# EAGLE design MasTer_Controler_Route_Fix (EAGLE 6.6.0)

## Sheet 1 of 2: PH Meter
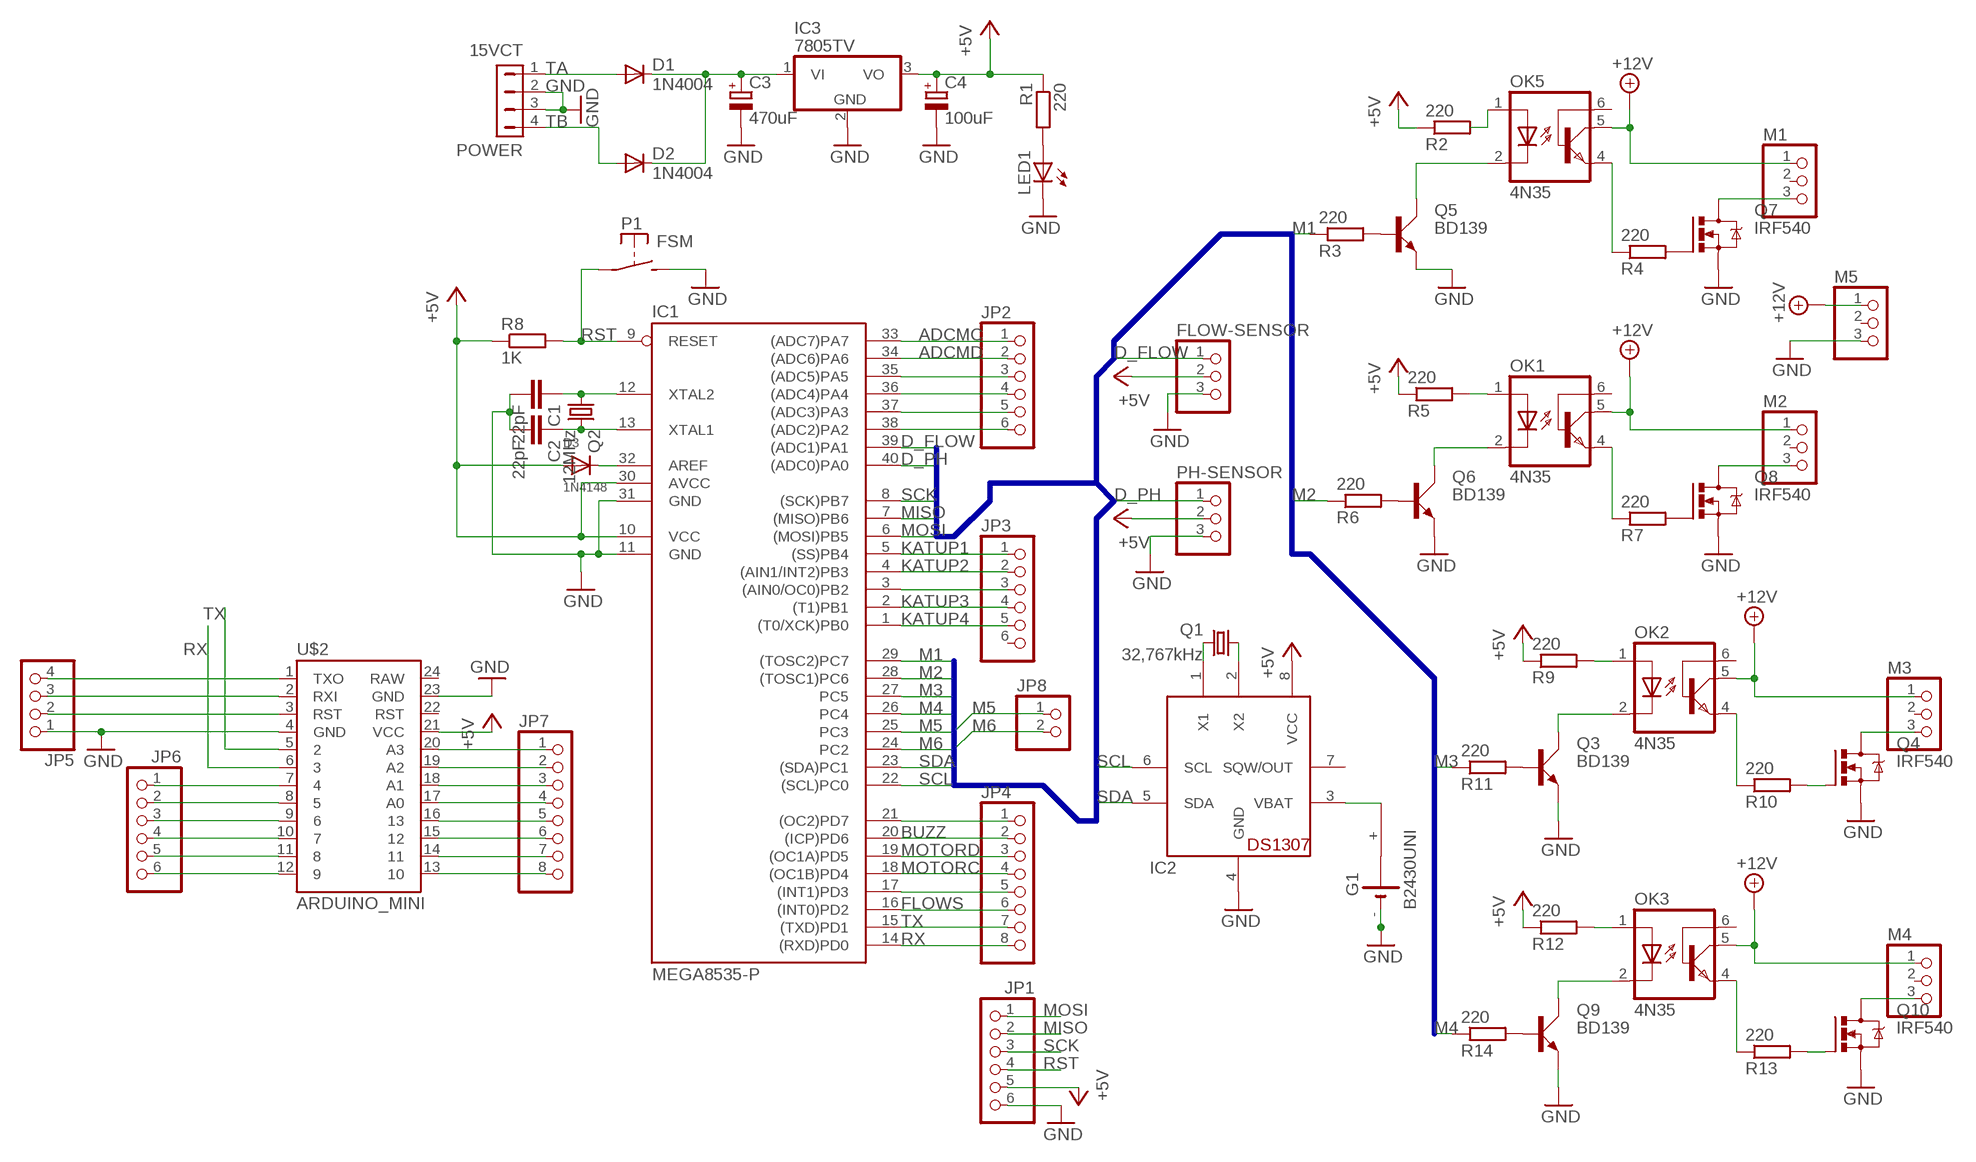
[diagram p0: schematic, sheet 1]

### Parts
15VCT  POWER  HDR-1X4-MTA-100  [MTA-100-4V]
C1  22pF  C2.5/4  [C2.5-4]
C2  22pF  C2.5/4  [C2.5-4]
C3  470uF  CPOL-EUE5-6  [E5-6]
C4  100uF  CPOL-EUE5-6  [E5-6]
D1  1N4004  [DO41-10]
D2  1N4004  [DO41-10]
D3  1N4148  DIODEDO-1N4148  [DO-1N4148]
FLOW-SENSOR  PINHD-1X3  [1X03]
G1  B2430UNI  [B2430UNI]
IC1  MEGA8535-P  [DIL40]
IC2  DS1307  [DIL08]
IC3  7805TV  [TO220V]
JP1  PINHD-1X6  [1X06]
JP2  PINHD-1X6  [1X06]
JP3  PINHD-1X6  [1X06]
JP4  PINHD-1X8CLEANBIG  [1X08-CLEANBIG]
JP5  PINHD-1X4  [1X04]
JP6  PINHD-1X6CB  [1X06-CLEANBIG]
JP7  PINHD-1X8CLEANBIG  [1X08-CLEANBIG]
JP8  PINHD-1X2  [1X02]
LED1  LED5MM  [LED5MM]
M1  PINHD-1X3  [1X03]
M2  PINHD-1X3  [1X03]
M3  PINHD-1X3  [1X03]
M4  PINHD-1X3  [1X03]
M5  PINHD-1X3  [1X03]
OK1  4N35  [DIL06]
OK2  4N35  [DIL06]
OK3  4N35  [DIL06]
OK5  4N35  [DIL06]
P1  FSM  [FSM]
PH-SENSOR  PINHD-1X3  [1X03]
Q1  32,767kHz  CRYSTALTC26H  [TC26H]
Q2  12MHz  CRYSTALHC49U70  [HC49U70]
Q3  BD139  [TO126AV]
Q4  IRF540  [TO220BV]
Q5  BD139  [TO126AV]
Q6  BD139  [TO126AV]
Q7  IRF540  [TO220BV]
Q8  IRF540  [TO220BV]
Q9  BD139  [TO126AV]
Q10  IRF540  [TO220BV]
R1  220  R-EU_0207/10  [0207/10]
R2  220  R-EU_0207/10  [0207/10]
R3  220  R-EU_0207/10  [0207/10]
R4  220  R-EU_0207/10  [0207/10]
R5  220  R-EU_0207/10  [0207/10]
R6  220  R-EU_0207/10  [0207/10]
R7  220  R-EU_0207/10  [0207/10]
R8  1K  R-EU_0207/10  [0207/10]
R9  220  R-EU_0207/10  [0207/10]
R10  220  R-EU_0207/10  [0207/10]
R11  220  R-EU_0207/10  [0207/10]
R12  220  R-EU_0207/10  [0207/10]
R13  220  R-EU_0207/10  [0207/10]
R14  220  R-EU_0207/10  [0207/10]
U$2  ARDUINO_MINI  [ARDUINO_MINI]

### Nets
+5V: C4.+ D3.A FLOW-SENSOR.2 IC1.10(VCC) IC1.30(AVCC) IC2.8(VCC) IC3.3(VO) JP1.5 PH-SENSOR.2 R1.1 R2.1 R5.1 R8.1 R9.1 R12.1 U$2.21(VCC)
+12V: M1.1 M2.1 M3.1 M4.1 M5.1 OK1.5(COL) OK2.5(COL) OK3.5(COL) OK5.5(COL)
ADCMC: IC1.33((ADC7)PA7) JP2.1
ADCMD: IC1.34((ADC6)PA6) JP2.2
BUZZ: IC1.20((ICP)PD6) JP4.2
D_FLOW: FLOW-SENSOR.1 IC1.39((ADC1)PA1)
D_PH: IC1.40((ADC0)PA0) PH-SENSOR.1
FLOWS: IC1.16((INT0)PD2) JP4.6
GND: 15VCT.2 15VCT.3 C1.2 C2.2 C3.- C4.- FLOW-SENSOR.3 G1.- G1.-@1(-) IC1.11(GND) IC1.31(GND) IC2.4(GND) IC3.2(GND) JP1.6 JP5.1 LED1.K(C) M5.3 P1.P$2(S) PH-SENSOR.3 Q3.E Q4.S Q5.E Q6.E Q7.S Q8.S Q9.E Q10.S U$2.4(GND) U$2.23(GND)
KATUP1: IC1.5((SS)PB4) JP3.1
KATUP2: IC1.4((AIN1/INT2)PB3) JP3.2
KATUP3: IC1.2((T1)PB1) JP3.4
KATUP4: IC1.1((T0/XCK)PB0) JP3.5
M1: IC1.29((TOSC2)PC7) R3.1
M2: IC1.28((TOSC1)PC6) R6.1
M3: IC1.27(PC5) R11.1
M4: IC1.26(PC4) R14.1
M5: IC1.25(PC3) JP8.1
M6: IC1.24(PC2) JP8.2
MISO: IC1.7((MISO)PB6) JP1.2
MOSI: IC1.6((MOSI)PB5) JP1.1
MOTORC: IC1.18((OC1B)PD4) JP4.4
MOTORD: IC1.19((OC1A)PD5) JP4.3
N$1: IC2.1(X1) Q1.2
N$2: IC2.2(X2) Q1.1
N$3: C1.1 IC1.12(XTAL2) Q2.1
N$4: C2.1 IC1.13(XTAL1) Q2.2
N$5: G1.+ IC2.3(VBAT)
N$6: LED1.A R1.2
N$7: C3.+ D1.C D2.C IC3.1(VI)
N$8: OK5.1(A) R2.2
N$9: OK5.2(C) Q5.C
N$10: Q5.B R3.2
N$11: Q7.G R4.2
N$12: OK5.4(EMI) R4.1
N$13: Q8.G R7.2
N$14: OK1.1(A) R5.2
N$15: OK1.2(C) Q6.C
N$16: Q6.B R6.2
N$17: M1.3 Q7.D
N$18: OK1.4(EMI) R7.1
N$19: M2.3 Q8.D
N$22: IC1.35((ADC5)PA5) JP2.3
N$23: IC1.36((ADC4)PA4) JP2.4
N$24: IC1.37((ADC3)PA3) JP2.5
N$25: IC1.38((ADC2)PA2) JP2.6
N$28: IC1.3((AIN0/OC0)PB2) JP3.3
N$31: IC1.21((OC2)PD7) JP4.1
N$35: IC1.17((INT1)PD3) JP4.5
N$37: JP5.4 U$2.1(TXO)
N$38: OK2.1(A) R9.2
N$39: OK2.2(C) Q3.C
N$40: D3.C IC1.32(AREF)
N$41: OK2.4(EMI) R10.1
N$42: M3.3 Q4.D
N$43: Q3.B R11.2
N$46: Q4.G R10.2
N$47: JP5.3 U$2.2(RXI)
N$48: OK3.1(A) R12.2
N$49: OK3.2(C) Q9.C
N$50: OK3.4(EMI) R13.1
N$51: M4.3 Q10.D
N$52: Q9.B R14.2
N$53: Q10.G R13.2
N$54: JP5.2 U$2.3(RST)
N$56: JP6.1 U$2.7
N$57: JP6.2 U$2.8
N$58: JP6.3 U$2.9
N$59: JP6.4 U$2.10
N$60: JP6.5 U$2.11
N$61: JP6.6 U$2.12
N$63: JP7.1 U$2.20(A3)
N$64: JP7.2 U$2.19(A2)
N$65: JP7.3 U$2.18(A1)
N$66: JP7.4 U$2.17(A0)
N$67: JP7.5 U$2.16
N$68: JP7.6 U$2.15
N$69: JP7.7 U$2.14
N$70: JP7.8 U$2.13
RST: IC1.9(RESET) JP1.4 P1.P$1(P) R8.2
RX: IC1.14((RXD)PD0) JP4.8 U$2.6
SCK: IC1.8((SCK)PB7) JP1.3
SCL: IC1.22((SCL)PC0) IC2.6(SCL)
SDA: IC1.23((SDA)PC1) IC2.5(SDA)
TA: 15VCT.1 D1.A
TB: 15VCT.4 D2.A
TX: IC1.15((TXD)PD1) JP4.7 U$2.5
Unconnected: G1.+@1(+) G1.+@2(+) G1.+@3(+) G1.+@4(+) IC2.7(SQW/OUT) JP3.6 M1.2 M2.2 M3.2 M4.2 M5.2 OK1.6(BAS) OK2.6(BAS) OK3.6(BAS) OK5.6(BAS) U$2.22(RST) U$2.24(RAW)

### Buses
B$1

## Sheet 2 of 2

## Library data of the parts
15VCT = con-hdrs40:HDR-1X4: HEADER CONNECTOR
C1 C2 = capacitor-wima:C: CAPACITOR naming: grid - package width
C3 C4 = rcl:CPOL-EU: POLARIZED CAPACITOR, European symbol
D1 D2 = diode:1N4004: DIODE general purpose rectifier, 1 A
D3 = adafruit:DIODE: Diode SMADIODE - SMA Surface Mount Package 20V 1A Schottky Diode Digikey: 641-1014-6-ND DO-1N4148 - Through Hole Small Current Diode SOD-123 20V 1 A (.5mV Vf) Schottky Diode - Digikey: MBRX120TPMSCT-ND SOD-323 10V 570mA (.38mV Vf, 3ns) Schottky Diode - Digikey: ZLLS410CT-ND SOD-523 30V 30mA Schottky Diode (RB751S-40TE61) - Digikey: RB751S-40TE61CT-ND SOT23-R/W - SOT23 Package (R = Solder Paste/Reflow Ovens, W = Hand-Soldering) BAT54Film 40V 300mA - Digikey: 497-7162-1-ND
FLOW-SENSOR M1-M5 PH-SENSOR = adafruit:PINHD-1X3: PIN HEADER
G1 = battery:B2430UNI: LI BATTERY
IC1 = atmel:MEGA8535-P: MICROCONTROLLER 8 Kbytes FLASH 512 bytes SRAM 512 bytes EEPROM USART 8-channel 10 bit ADC Source: avr.lbr; MPN: ATMEGA8535-16PU; OC_FARNELL: 9171444; OC_NEWARK: 01M6909
IC2 = adafruit:DS1307: DS1307 Real time clock (RTC) with battery backup ability. Talk to it via i2c
IC3 = linear:78*: Positive VOLTAGE REGULATOR Source: http://cache.national.com/ds/LM/LM78L05.pdf http://www.fairchildsemi.com/ds/LM/LM7805.pdf
JP1-JP3 JP6 = adafruit:PINHD-1X6: PIN HEADER
JP4 JP7 = adafruit:PINHD-1X8: PIN HEADER
JP5 = pinhead:PINHD-1X4: PIN HEADER
JP8 = pinhead:PINHD-1X2: PIN HEADER
LED1 = adafruit:LED: LED OSRAM: - CHIPLED LG R971, LG N971, LY N971, LG Q971, LY Q971, LO R971, LY R971 LH N974, LH R974 LS Q976, LO Q976, LY Q976 LO Q996 - Hyper CHIPLED LW Q18S LB Q993, LB Q99A, LB R99A - SideLED LS A670, LO A670, LY A670, LG A670, LP A670 LB A673, LV A673, LT A673, LW A673 LH A674 LY A675 LS A676, LA A676, LO A676, LY A676, LW A676 LS A679, LY A679, LG A679 - Hyper Micro SIDELED® LS Y876, LA Y876, LO Y876, LY Y876 LT Y87S - SmartLED LW L88C, LW L88S LB L89C, LB L89S, LG L890 LS L89K, LO L89K, LY L89K LS L896, LA L896, LO L896, LY L896 - TOPLED LS T670, LO T670, LY T670, LG T670, LP T670 LSG T670, LSP T670, LSY T670, LOP T670, LYG T670 LG T671, LOG T671, LSG T671 LB T673, LV T673, LT T673, LW T673 LH T674 LS T676, LA T676, LO T676, LY T676, LB T676, LH T676, LSB T676, LW T676 LB T67C, LV T67C, LT T67C, LS T67K, LO T67K, LY T67K, LW E67C LS E67B, LA E67B, LO E67B, LY E67B, LB E67C, LV E67C, LT E67C LW T67C LS T679, LY T679, LG T679 LS T770, LO T770, LY T770, LG T770, LP T770 LB T773, LV T773, LT T773, LW T773 LH T774 LS E675, LA E675, LY E675, LS T675 LS T776, LA T776, LO T776, LY T776, LB T776 LHGB T686 LT T68C, LB T68C - Hyper Mini TOPLED® LB M676 - Mini TOPLED Santana® LG M470 LS M47K, LO M47K, LY M47K Source: http://www.osram.convergy.de/
OK1-OK3 OK5 = optocoupler:4N35: MOTOROLA OPTO COUPLER; MF: FAIRCHILD SEMICONDUCTOR; MPN: 4N35; OC_FARNELL: 1328375; OC_NEWARK: 72K9946
P1 = switch-misc:FSM: TYCO SWITCH
Q1 Q2 = crystal:CRYSTAL: CRYSTAL; OC_FARNELL: unknown; OC_NEWARK: unknown
Q3 Q5 Q6 Q9 = transistor-power:BD139: NPN TRANSISTOR
Q4 Q7 Q8 Q10 = transistor-power:IRF540: HEXFET Power MOSFET
R1-R14 = resistor:R-EU_: RESISTOR, European symbol
U$2 = SparkFun-Boards:ARDUINO_MINI: Arduino Pro Mini footprint

## Board
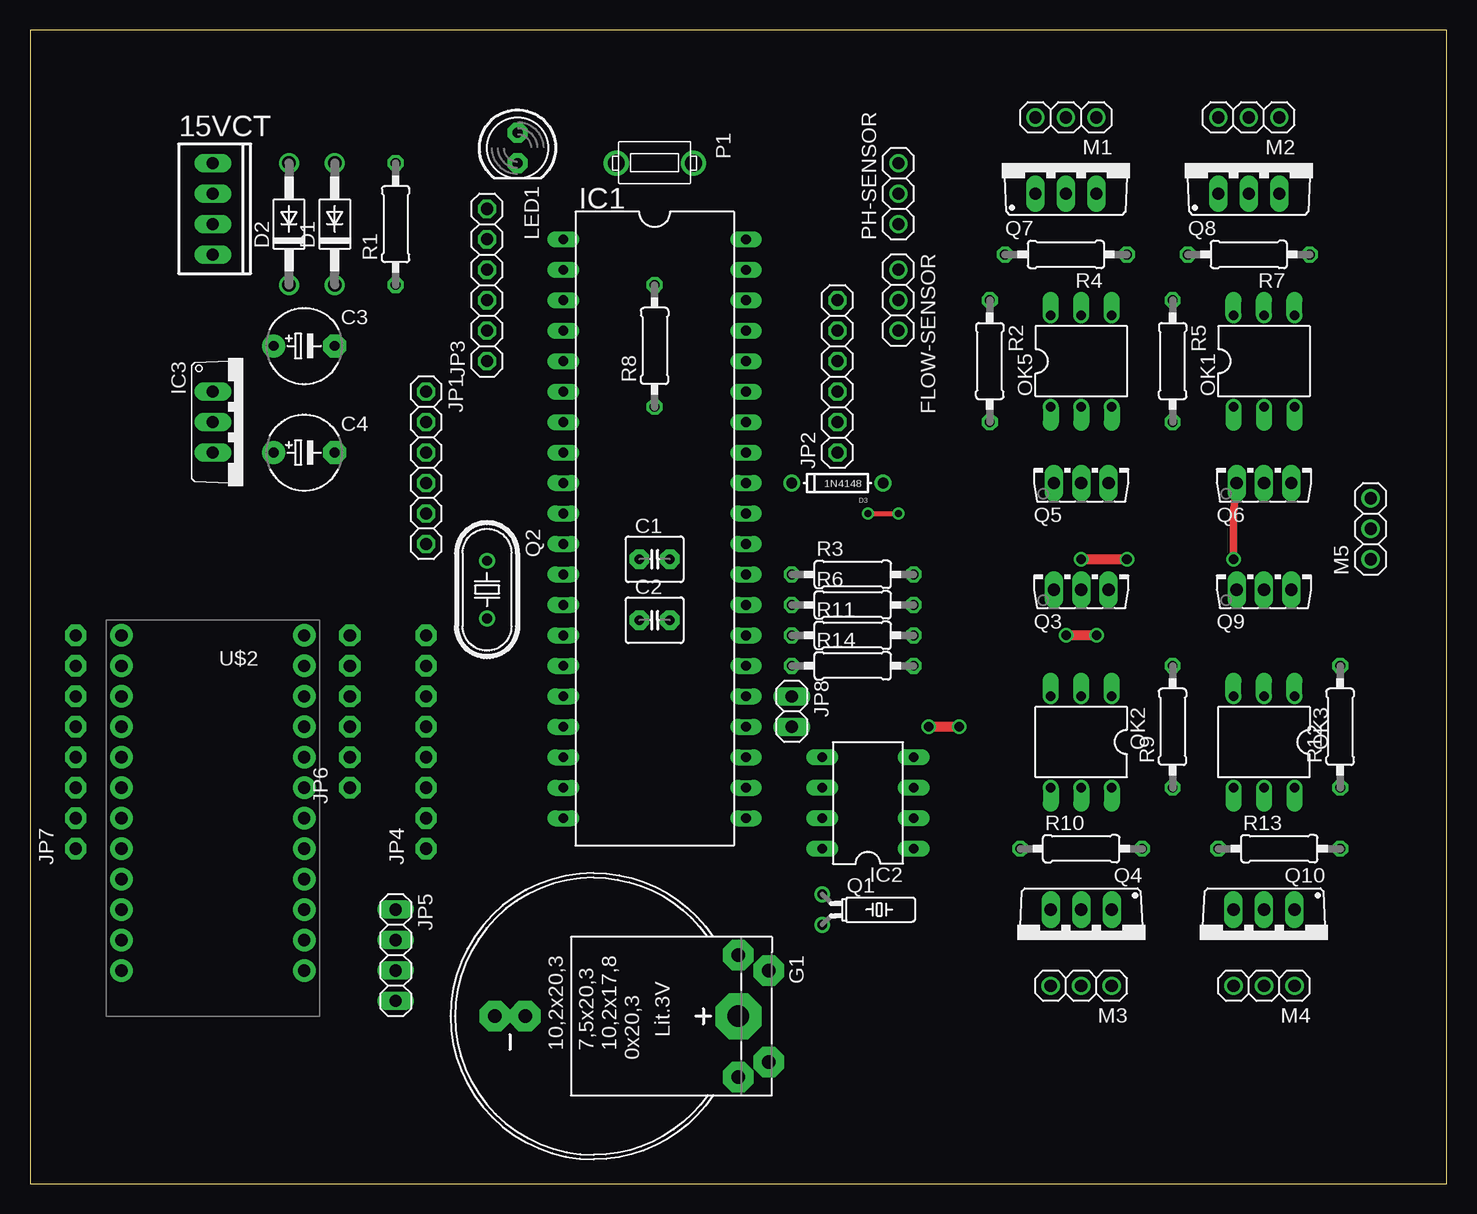
[diagram p1: board, top side]
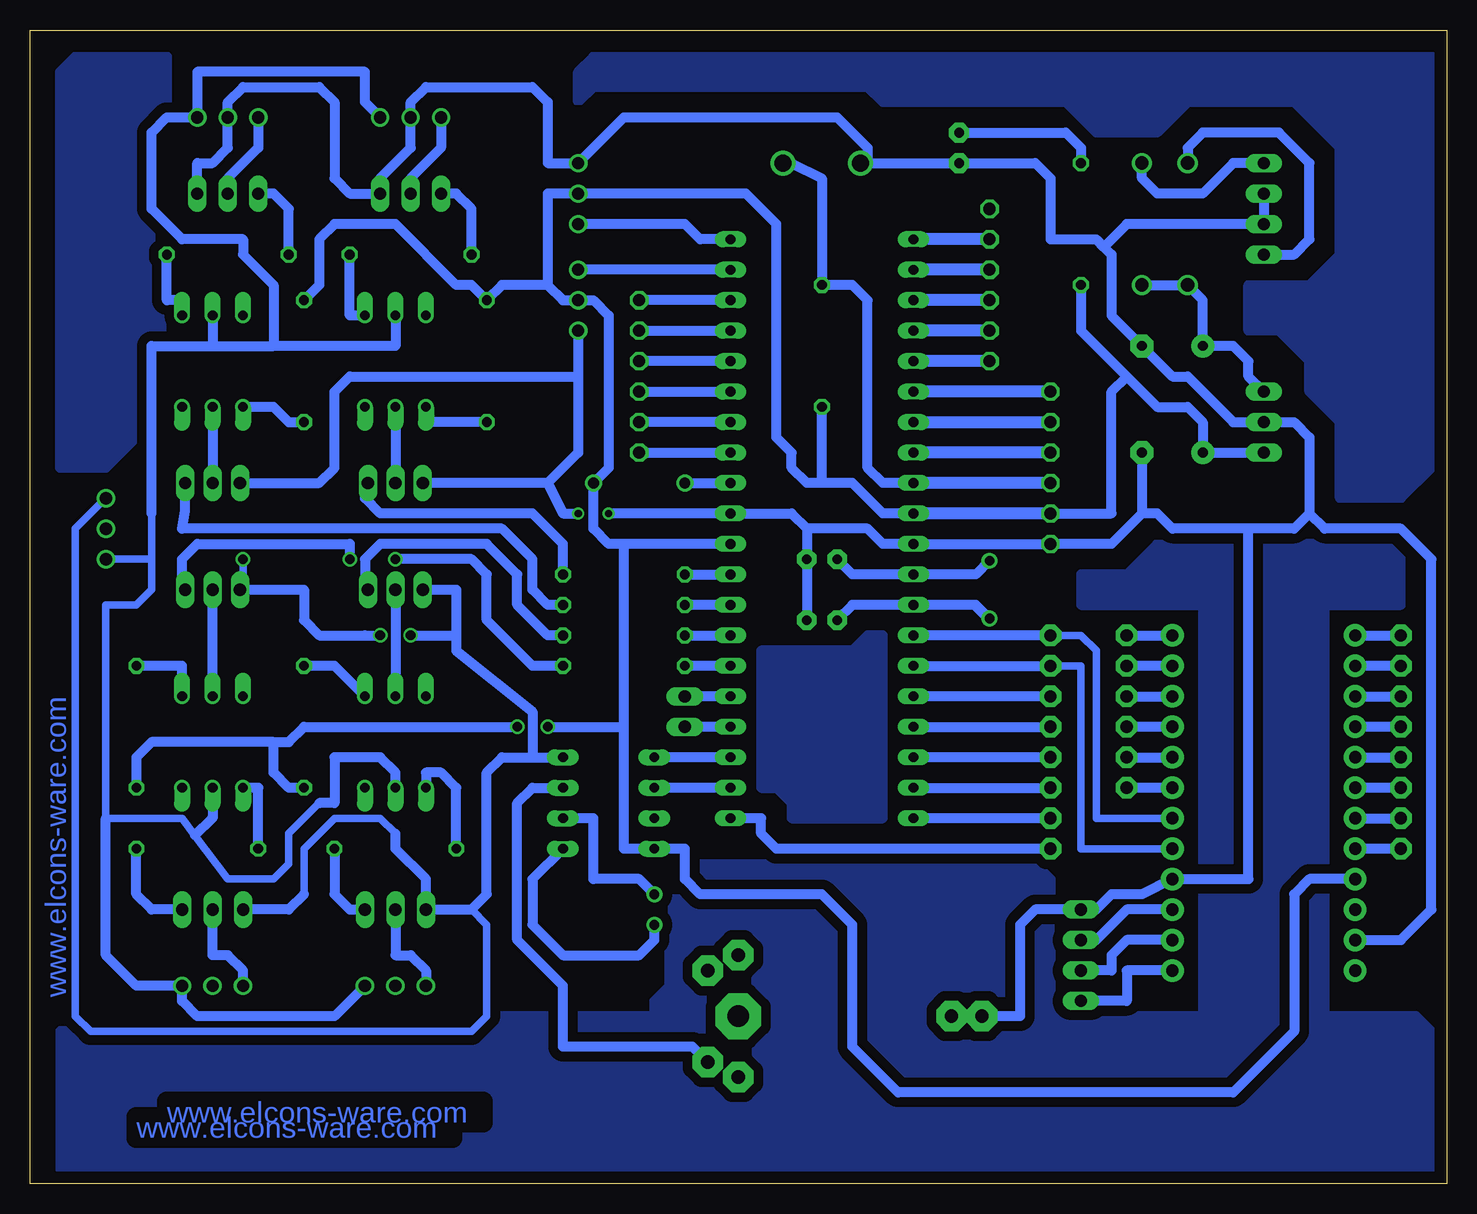
[diagram p2: board, bottom side, seen from below]

Size 118.09 x 96.19 mm. Coordinates in mm from the lower left corner, seen from the top.
Outline: 0,0 118.09,0 118.09,96.19 0,96.19 0,0
Copper layers (1*16): Top 0.035mm / dielectric 1.5mm / Bottom 0.035mm
Design rules "default": minimum track width 10mil, minimum drill 24mil, track to track 8mil, track to pad 8mil, pad to pad 8mil, via to via 8mil, smd to smd 8mil, copper to edge 40mil, drill to drill 8mil, minimum pad ring 10mil, minimum via ring 8mil, stop-mask expansion 4mil, vias tented up to drill 0mil, thermal gap 10mil

### Footprints (pad centres in the part's own frame; a part is rotated, then mirrored left to right if it is on the bottom)
MTA-100-4V = drill 1.016 long: 1 -3.81,0; 2 -1.27,0; 3 1.27,0; 4 3.81,0
C2.5-4 = drill 0.813 pad 1.6 octagon: 1 -1.27,0; 2 1.27,0
E5-6 = drill 0.813 pad 1.905: + -2.54,0 | drill 0.813 pad 1.905 octagon: - 2.54,0
DO41-10 = drill 1.118: A 5.08,0; C -5.08,0
DO-1N4148 = drill 0.9: A -3.81,0; C 3.81,0
1X03 = drill 1.016: 1 -2.54,0; 2 0,0; 3 2.54,0
B2430UNI = drill 1.118 pad 2.54 octagon: + 3.81,14.605; +@1 -3.81,14.605; +@2 -5.08,12.065; +@3 5.08,12.065; - 0,-5.715; -@1 0,-8.255 | drill 1.803 pad 3.81 octagon: +@4 0,12.065
DIL40 = drill 0.813 long: 1 -24.13,-7.62; 2 -21.59,-7.62; 3 -19.05,-7.62; 4 -16.51,-7.62; 5 -13.97,-7.62; 6 -11.43,-7.62; 7 -8.89,-7.62; 8 -6.35,-7.62; 9 -3.81,-7.62; 10 -1.27,-7.62; 11 1.27,-7.62; 12 3.81,-7.62; 13 6.35,-7.62; 14 8.89,-7.62; 15 11.43,-7.62; 16 13.97,-7.62; 17 16.51,-7.62; 18 19.05,-7.62; 19 21.59,-7.62; 20 24.13,-7.62; 21 24.13,7.62; 22 21.59,7.62; 23 19.05,7.62; 24 16.51,7.62; 25 13.97,7.62; 26 11.43,7.62; 27 8.89,7.62; 28 6.35,7.62; 29 3.81,7.62; 30 1.27,7.62; 31 -1.27,7.62; 32 -3.81,7.62; 33 -6.35,7.62; 34 -8.89,7.62; 35 -11.43,7.62; 36 -13.97,7.62; 37 -16.51,7.62; 38 -19.05,7.62; 39 -21.59,7.62; 40 -24.13,7.62
DIL08 = drill 0.813 long: 1 -3.81,-3.81; 2 -1.27,-3.81; 3 1.27,-3.81; 4 3.81,-3.81; 5 3.81,3.81; 6 1.27,3.81; 7 -1.27,3.81; 8 -3.81,3.81
TO220V = drill 1.016 long: 1 -2.54,-2.54; 2 0,-2.54; 3 2.54,-2.54
1X06 = drill 1.016 octagon: 1 -6.35,0; 2 -3.81,0; 3 -1.27,0; 4 1.27,0; 5 3.81,0; 6 6.35,0
1X08-CLEANBIG = drill 1.016 pad 1.778 octagon: 1 -8.89,0; 2 -6.35,0; 3 -3.81,0; 4 -1.27,0; 5 1.27,0; 6 3.81,0; 7 6.35,0; 8 8.89,0
1X04 = drill 1.016 long: 1 -3.81,0; 2 -1.27,0; 3 1.27,0; 4 3.81,0
1X06-CLEANBIG = drill 1.016 pad 1.778 octagon: 1 -6.35,0; 2 -3.81,0; 3 -1.27,0; 4 1.27,0; 5 3.81,0; 6 6.35,0
1X02 = drill 1.016 long: 1 -1.27,0; 2 1.27,0
LED5MM = drill 0.813 pad 1.676 octagon: A -1.27,0; K 1.27,0
DIL06 = drill 0.813 offset: 1 -2.54,-3.81; 2 0,-3.81; 3 2.54,-3.81; 4 2.54,3.81; 5 0,3.81; 6 -2.54,3.81
FSM = drill 1.397: P$1 0,3.25; P$2 0,-3.2
TC26H = drill 0.813: 1 -1.27,0; 2 1.27,0
HC49U70 = drill 0.813: 1 -2.413,0; 2 2.413,0
TO126AV = drill 1.016 long: B 2.286,-1.27; C 0,-1.27; E -2.286,-1.27
TO220BV = drill 1.016 long: D 0,-2.54; G -2.54,-2.54; S 2.54,-2.54
0207/10 = drill 0.813 octagon: 1 -5.08,0; 2 5.08,0
ARDUINO_MINI = drill 1.016 pad 1.88: 1 -7.62,12.7; 2 -7.62,10.16; 3 -7.62,7.62; 4 -7.62,5.08; 5 -7.62,2.54; 6 -7.62,0; 7 -7.62,-2.54; 8 -7.62,-5.08; 9 -7.62,-7.62; 10 -7.62,-10.16; 11 -7.62,-12.7; 12 -7.62,-15.24; 13 7.62,-15.24; 14 7.62,-12.7; 15 7.62,-10.16; 16 7.62,-7.62; 17 7.62,-5.08; 18 7.62,-2.54; 19 7.62,0; 20 7.62,2.54; 21 7.62,5.08; 22 7.62,7.62; 23 7.62,10.16; 24 7.62,12.7

### Placement (x,y rotation side)
15VCT  15.24,81.28 270 top
C1  52.07,52.07 0 top
C2  52.07,46.99 0 top
C3  22.86,69.85 0 top
C4  22.86,60.96 0 top
D1  25.4,80.01 90 top
D2  21.59,80.01 90 top
D3  67.31,58.42 180 top
FLOW-SENSOR  72.39,73.66 270 top
G1  46.99,13.97 270 top
IC1  52.07,54.61 270 top
IC2  69.85,31.75 90 top
IC3  17.78,63.5 270 top
JP1  33.02,59.69 270 top
JP2  67.31,67.31 90 top
JP3  38.1,74.93 90 top
JP4  33.02,36.83 90 top
JP5  30.48,19.05 270 top
JP6  26.67,39.37 90 top
JP7  3.81,36.83 90 top
JP8  63.5,39.37 270 top
LED1  40.64,86.36 270 top
M1  86.36,88.9 180 top
M2  101.6,88.9 180 top
M3  87.63,16.51 180 top
M4  102.87,16.51 180 top
M5  111.76,54.61 90 top
OK1  102.87,68.58 0 top
OK2  87.63,36.83 180 top
OK3  102.87,36.83 180 top
OK5  87.63,68.58 0 top
P1  52.07,85.09 270 top
PH-SENSOR  72.39,82.55 90 top
Q1  66.04,22.86 270 top
Q2  38.1,49.53 270 top
Q3  87.63,50.8 0 top
Q4  87.63,20.32 180 top
Q5  87.63,59.69 0 top
Q6  102.87,59.69 0 top
Q7  86.36,85.09 0 top
Q8  101.6,85.09 0 top
Q9  102.87,50.8 0 top
Q10  102.87,20.32 180 top
R1  30.48,80.01 90 top
R2  80.01,68.58 270 top
R3  68.58,50.8 0 top
R4  86.36,77.47 180 top
R5  95.25,68.58 270 top
R6  68.58,48.26 0 top
R7  101.6,77.47 180 top
R8  52.07,69.85 90 top
R9  95.25,38.1 90 top
R10  87.63,27.94 0 top
R11  68.58,45.72 0 top
R12  109.22,38.1 90 top
R13  104.14,27.94 0 top
R14  68.58,43.18 0 top
U$2  15.24,30.48 180 top

### Tracks (layer width: path | path; a pad name or v marks a point on that pad's centre or on a via)
+5V  (via drill 0.8)
  Top 0.813: v77.47,38.1 v74.93,38.1
  Bottom 0.813: R1.1 30.48,71.12 26.67,67.31 | 26.67,67.31 24.13,64.77 21.59,64.77 20.32,63.5 C4.+ IC3.3 | JP1.5 27.94,55.88 27.94,66.04 26.67,67.31 | IC1.30 68.58,53.34 | 68.58,53.34 69.85,53.34 71.12,54.61 D3.A 69.85,59.69 69.85,72.39 71.12,73.66 FLOW-SENSOR.2 73.66,73.66 74.93,74.93 | 68.58,38.1 68.58,27.94 IC2.8 63.5,27.94 63.5,25.4 62.23,24.13 52.07,24.13 49.53,21.59 49.53,11.43 45.72,7.62 17.78,7.62 12.7,12.7 12.7,24.13 11.43,25.4 U$2.21 | 68.58,38.1 68.58,53.34 | 74.93,74.93 74.93,82.55 PH-SENSOR.2 58.42,82.55 55.88,80.01 55.88,62.23 54.61,60.96 54.61,59.69 53.34,58.42 52.07,58.42 | IC1.10 46.99,55.88 49.53,58.42 52.07,58.42 | 52.07,58.42 R8.1 | R9.1 96.52,33.02 97.79,34.29 97.79,36.83 | 97.79,36.83 107.95,36.83 109.22,35.56 R12.1 | 74.93,74.93 78.74,74.93 R2.1 81.28,74.93 82.55,74.93 87.63,80.01 92.71,80.01 93.98,78.74 93.98,74.93 R5.1 | v74.93,38.1 68.58,38.1 | v77.47,38.1 95.25,38.1 96.52,36.83 97.79,36.83
  Bottom 1.016: JP1.5 IC1.10
+12V
  Bottom 0.61: 93.98,31.75 96.52,29.21 96.52,26.67 97.79,25.4 101.6,25.4 104.34,29.06 105.41,30.48 111.76,30.48 111.76,48.26 109.22,48.26 107.95,49.53 107.95,52.07 | M5.1 107.95,52.07 | 107.95,52.07 107.95,55.88
  Bottom 0.813: M3.1 92.71,13.97 104.14,13.97 105.41,15.24 M4.1 109.22,16.51 111.76,19.05 111.76,30.48 | 97.79,69.85 87.63,69.85 OK5.5 | M1.1 90.17,90.17 90.17,92.71 104.14,92.71 M2.1 106.68,88.9 107.95,87.63 107.95,81.28 105.41,78.74 100.33,78.74 100.33,77.47 97.79,74.93 97.79,69.85 | 107.95,55.88 107.95,69.85 102.87,69.85 | 102.87,69.85 97.79,69.85 | OK1.5 102.87,69.85 | OK3.5 102.87,30.48 102.92,30.48 104.34,29.06 | OK2.5 87.63,34.29 88.9,35.56 92.71,35.56 92.71,31.75 93.98,31.75
ADCMC
  Bottom 0.813: JP2.1 IC1.33
ADCMD
  Bottom 0.813: IC1.34 JP2.2
BUZZ
  Bottom 0.813: JP4.2 IC1.20
D_FLOW
  Bottom 0.813: IC1.39 FLOW-SENSOR.1
D_PH
  Bottom 0.813: IC1.40 62.23,78.74 63.5,80.01 PH-SENSOR.1
FLOWS
  Bottom 0.813: JP4.6 IC1.16
GND  (via drill 0.6, 0.8)
  Top 0.406: v69.85,55.88 v72.39,55.88
  Top 0.61: v100.33,52.07 100.33,55.88 Q6.E
  Top 0.813: v88.9,45.72 v86.36,45.72
  Bottom 0.61: 87.63,29.21 88.9,30.48 92.71,30.48 95.25,27.94 95.25,24.13 | v100.33,52.07 100.33,49.53 Q9.E | 81.28,22.86 80.01,21.59 80.01,13.97 81.28,12.7 113.03,12.7 114.3,13.97 114.3,54.61 M5.3
  Bottom 0.813: P1.P$2 48.26,85.09 | 48.26,85.09 LED1.K 34.29,85.09 33.02,83.82 33.02,78.74 29.21,78.74 28.57,78.11 | 28.57,78.11 27.94,77.47 27.94,72.39 C3.- 22.86,67.31 21.59,67.31 17.78,63.5 IC3.2 12.7,63.5 11.43,62.23 11.43,55.88 | C4.- 25.4,55.88 | 25.4,55.88 27.94,53.34 JP1.6 IC1.11 46.99,53.34 48.26,54.61 53.34,54.61 | 11.43,55.88 12.7,54.61 16.51,54.61 | 16.51,54.61 22.86,54.61 24.13,55.88 25.4,55.88 | 15VCT.2 15VCT.3 26.67,80.01 28.57,78.11 | 53.34,54.61 C1.2 C2.2 | 48.26,85.09 48.26,86.36 50.8,88.9 68.58,88.9 PH-SENSOR.3 74.93,85.09 74.93,90.17 76.2,91.44 85.09,91.44 86.36,90.17 86.36,86.36 88.9,83.82 Q7.S 91.44,82.55 92.71,83.82 92.71,90.17 93.98,91.44 100.33,91.44 101.6,90.17 101.6,86.36 102.87,85.09 104.14,85.09 Q8.S | FLOW-SENSOR.3 72.39,67.31 | 72.39,67.31 72.39,60.96 74.93,58.42 | 74.93,58.42 Q5.E | 53.34,54.61 54.61,55.88 IC1.31 v69.85,55.88 | Q3.E 82.55,49.53 82.55,45.72 | 82.55,45.72 82.55,44.45 76.2,39.37 76.2,35.56 | 76.2,35.56 IC2.4 | 76.2,35.56 78.74,35.56 80.01,34.29 80.01,24.13 81.28,22.86 Q4.S 85.09,25.4 87.63,27.94 87.63,29.21 | 95.25,24.13 96.52,22.86 Q10.S | Q6.E 93.98,58.42 92.71,59.69 92.71,66.04 91.44,67.31 72.39,67.31 | v86.36,45.72 82.55,45.72 | 90.17,45.72 v88.9,45.72 93.98,45.72 95.25,46.99 95.25,49.53 100.33,49.53 | v72.39,55.88 73.66,55.88 74.93,58.42 | G1.- G1.-@1 35.56,13.97 35.56,21.59 34.29,22.86 JP5.1 29.21,22.86 27.94,24.13 25.4,24.13 U$2.4 16.51,25.4 16.51,54.61 | U$2.23 3.81,20.32 1.27,22.86 1.27,52.07 3.81,54.61 10.16,54.61 11.43,55.88
KATUP1
  Bottom 1.016: JP3.1 IC1.5
KATUP2
  Bottom 1.016: JP3.2 IC1.4
KATUP3
  Bottom 1.016: JP3.4 IC1.2
KATUP4
  Bottom 1.016: JP3.5 IC1.1
M1
  Bottom 0.813: R3.1 IC1.29
M2
  Bottom 0.813: IC1.28 R6.1
M3
  Bottom 0.813: R11.1 IC1.27
M4
  Bottom 0.813: IC1.26 R14.1
M5
  Bottom 0.813: IC1.25 JP8.1
M6
  Bottom 0.813: IC1.24 JP8.2
MISO
  Bottom 1.016: IC1.7 JP1.2
MOSI
  Bottom 1.016: JP1.1 IC1.6
MOTORC
  Bottom 0.813: JP4.4 IC1.18
MOTORD
  Bottom 0.813: IC1.19 JP4.3
N$1
  Bottom 0.813: IC2.1 76.2,25.4 76.2,21.59 73.66,19.05 67.31,19.05 66.04,20.32 Q1.2
N$2
  Bottom 0.813: Q1.1 67.31,25.4 71.12,25.4 71.12,30.48 IC2.2
N$3
  Bottom 0.813: Q2.1 39.24,50.8 IC1.12 49.53,50.8 C1.1
N$4
  Bottom 0.813: 39.37,48.26 38.23,47.12 Q2.2 39.24,48.26 39.37,48.26 | 39.37,48.26 IC1.13 49.53,48.26 C2.1
N$5
  Bottom 0.813: IC2.3 76.2,33.02 77.47,31.75 77.47,20.32 73.66,16.51 73.66,11.43 62.87,11.43 G1.+
N$6
  Bottom 0.813: LED1.A 31.75,87.63 30.48,86.36 R1.2
N$7
  Bottom 0.813: IC3.1 16.51,67.31 16.51,68.58 17.78,69.85 C3.+ 20.32,73.66 D2.C D1.C
N$8
  Bottom 0.813: R2.2 85.09,63.5 OK5.1
N$9
  Bottom 0.813: OK5.2 Q5.C
N$10
  Bottom 0.813: R3.2 73.66,53.34 76.2,55.88 88.9,55.88 90.17,57.15 90.17,58.17 Q5.B
N$11
  Bottom 0.813: R4.2 81.28,81.28 82.55,82.55 Q7.G
N$12
  Bottom 0.813: R4.1 91.44,72.39 OK5.4
N$13
  Bottom 0.813: R7.2 96.52,81.28 97.79,82.55 Q8.G
N$14
  Bottom 0.813: R5.2 96.52,63.5 97.79,64.77 OK1.1
N$15
  Bottom 0.813: OK1.2 Q6.C
N$16
  Bottom 0.813: R6.2 74.93,48.26 76.2,49.53 76.2,52.07 78.74,54.61 105.41,54.61 105.16,56.13 Q6.B
N$17
  Bottom 0.813: M1.3 83.82,86.36 86.36,83.82 Q7.D
N$18
  Bottom 0.813: R7.1 106.68,73.66 105.41,73.66 OK1.4
N$19
  Bottom 0.813: M2.3 99.06,86.36 101.6,83.82 Q8.D
N$22
  Bottom 0.813: JP2.3 IC1.35
N$23
  Bottom 0.813: IC1.36 JP2.4
N$24
  Bottom 0.813: JP2.5 IC1.37
N$25
  Bottom 0.813: IC1.38 JP2.6
N$28
  Bottom 1.016: JP3.3 IC1.3
N$31
  Bottom 0.813: JP4.1 55.88,27.94 57.15,29.21 57.15,30.48 IC1.21
N$35
  Bottom 0.813: IC1.17 JP4.5
N$37
  Bottom 0.813: U$2.1 26.67,17.78 26.67,15.24 JP5.4
N$38
  Bottom 0.813: R9.2 92.71,43.18 OK2.1
N$39
  Bottom 0.813: Q3.C OK2.2
N$40
  Bottom 0.813: D3.C IC1.32
N$41
  Bottom 0.813: R10.1 82.55,33.02 83.82,34.29 85.09,34.29 OK2.4
N$42
  Bottom 0.813: Q4.D 87.63,19.05 86.36,19.05 85.09,17.78 M3.3
N$43
  Bottom 0.813: R11.2 74.93,45.72 77.47,48.26 77.47,50.8 80.01,53.34 88.9,53.34 90.17,52.07 90.17,49.53 Q3.B
N$44
  pour Bottom (isolate 0.813): 1.27,93.98 1.27,59.69 3.81,57.15 8.89,57.15 8.89,63.5 11.43,66.04 11.43,68.58 13.97,71.12 16.51,71.12 16.51,74.93 11.43,74.93 8.89,77.47 8.89,86.36 12.7,90.17 21.59,90.17 24.13,87.63 27.94,87.63 29.21,87.63 31.75,90.17 38.1,90.17 46.99,90.17 48.26,91.44 69.85,91.44 71.12,91.44 72.39,90.17 72.39,92.71 71.12,93.98
N$45
  pour Bottom (isolate 0.813): 2.54,13.97 114.3,13.97 115.57,12.7 115.57,1.27 1.27,1.27 1.27,12.7
N$46
  Bottom 0.813: R10.2 92.71,24.13 91.44,22.86 Q4.G
N$47
  Bottom 0.813: U$2.2 26.67,20.32 27.94,19.05 27.94,17.78 JP5.3
N$48
  Bottom 0.813: R12.2 105.41,43.18 OK3.1
N$49
  Bottom 0.813: OK3.2 Q9.C
N$50
  Bottom 0.813: R13.1 99.06,33.02 OK3.4
N$51
  Bottom 0.813: M4.3 100.33,17.78 101.6,19.05 102.87,19.05 Q10.D
N$52  (via drill 0.8)
  Top 0.813: v87.63,52.07 v91.44,52.07
  Bottom 0.813: Q9.B 105.41,49.53 105.41,52.07 104.14,53.34 91.44,53.34 v91.44,52.07 | R14.2 76.2,43.18 80.01,46.99 80.01,50.8 81.28,52.07 v87.63,52.07
N$53
  Bottom 0.813: Q10.G 107.95,22.86 109.22,24.13 R13.2
N$54
  Bottom 0.813: U$2.3 26.67,22.86 29.21,20.32 JP5.2
N$55
  pour Bottom (isolate 0.813): 115.57,59.69 115.57,92.71 114.3,93.98 106.68,93.98 106.68,64.77 111.76,59.69
N$56
  Bottom 0.813: U$2.7 JP6.1
N$57
  Bottom 0.813: JP6.2 U$2.8
N$58
  Bottom 0.813: U$2.9 JP6.3
N$59
  Bottom 0.813: JP6.4 U$2.10
N$60
  Bottom 0.813: U$2.11 JP6.5
N$61
  Bottom 0.813: JP6.6 U$2.12
N$62
  pour Bottom (isolate 0.813): 33.02,25.4 33.02,12.7 64.77,12.7 66.04,13.97 66.04,15.24 64.77,16.51 64.77,26.67 34.29,26.67
N$63
  Bottom 0.813: JP7.1 U$2.20
N$64
  Bottom 0.813: U$2.19 JP7.2
N$65
  Bottom 0.813: JP7.3 U$2.18
N$66
  Bottom 0.813: U$2.17 JP7.4
N$67
  Bottom 0.813: JP7.5 U$2.16
N$68
  Bottom 0.813: U$2.15 JP7.6
N$69
  Bottom 0.813: JP7.7 U$2.14
N$70
  Bottom 0.813: U$2.13 JP7.8
N$71
  pour Bottom (isolate 0.813): 5.08,53.34 24.13,53.34 26.67,50.8 30.48,50.8 30.48,48.26 20.32,48.26 20.32,12.7 10.16,12.7 10.16,48.26 3.81,48.26 3.81,52.07
N$72
  pour Bottom (isolate 0.813): 46.99,45.72 48.26,45.72 49.53,44.45 55.88,44.45 57.15,44.45 57.15,33.02 55.88,33.02 54.61,31.75 54.61,30.48 46.99,30.48
RST
  Bottom 0.813: IC1.9 46.99,58.42 48.26,59.69 48.26,73.66 49.53,74.93 R8.2 52.07,83.82 54.61,85.09 P1.P$1
  Bottom 1.016: JP1.4 IC1.9
RX
  Bottom 0.61: U$2.6 29.21,30.48 29.21,44.45 30.48,45.72 JP4.8
  Bottom 0.813: JP4.8 IC1.14
SCK
  Bottom 1.016: JP1.3 IC1.8
SCL
  Bottom 0.813: IC1.22 IC2.6
SDA
  Bottom 0.813: IC1.23 IC2.5
TA
  Bottom 0.813: 15VCT.1 17.78,85.09 20.32,82.55 24.13,82.55 25.4,83.82 D1.A
TB
  Bottom 0.813: 15VCT.4 12.7,77.47 11.43,78.74 11.43,85.09 13.97,87.63 20.32,87.63 21.59,86.36 D2.A
TX
  Bottom 0.61: U$2.5 30.48,27.94 30.48,43.18 JP4.7
  Bottom 0.813: IC1.15 JP4.7

### Text on the board
Bottom: www.elcons-ware.com | www.elcons-ware.com | www.elcons-ware.com